# EasyEDA schematic SCH_esp_micro_usb.json
TITLE: Sheet_1; REV: 1.0; Date: 2022-09-20; Sheet: 1/1; Drawn By: elanworld; Company: Your Company
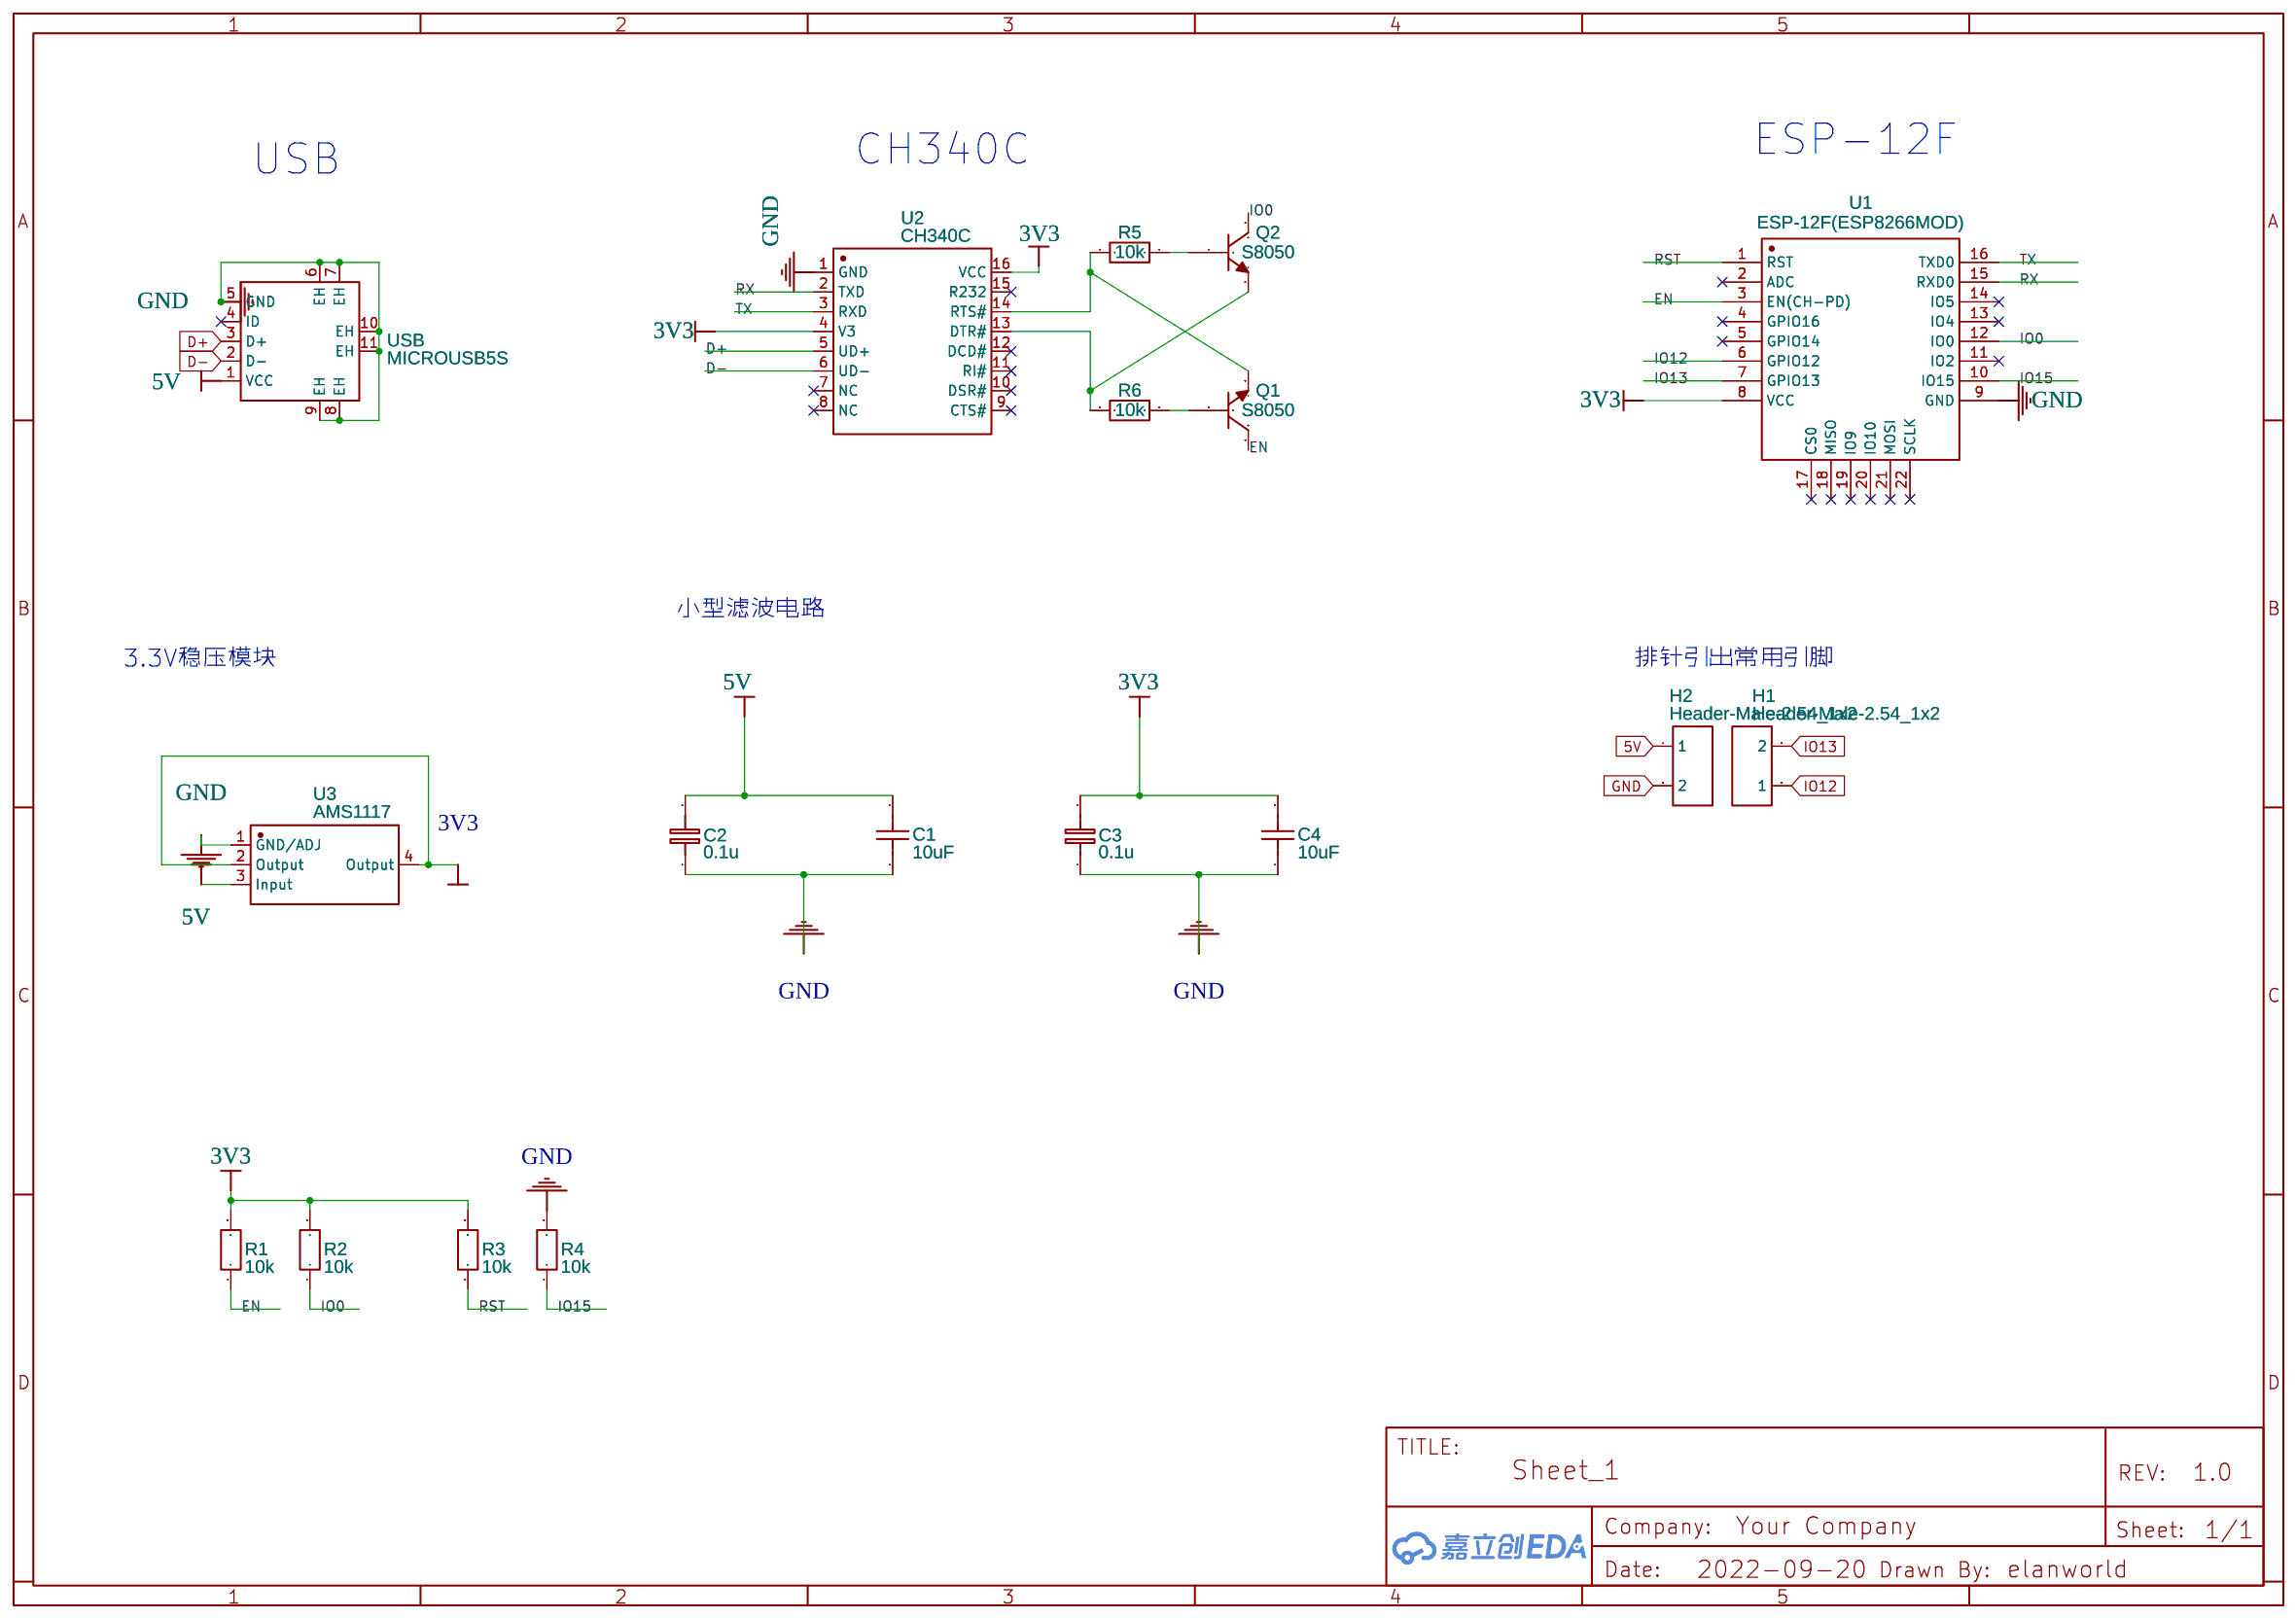
[diagram p0: schematic sheet]

## Parts
C1  10uF  [C0603]
C2  0.1u  [C0603]
C3  0.1u  [C0603]
C4  10uF  [C0603]
H1  Header-Male-2.54_1x2  [HDR-TH_2P-P2.54-V-M-1]
H2  Header-Male-2.54_1x2  [HDR-TH_2P-P2.54-V-M-1]
Q1  S8050  [SOT-23-3_L2.9-W1.5-P1.90-LS2.6-BL]
Q2  S8050  [SOT-23-3_L2.9-W1.5-P1.90-LS2.6-BL]
R1  10k  [R0603]
R2  10k  [R0603]
R3  10k  [R0603]
R4  10k  [R0603]
R5  10k  [R0603]
R6  10k  [R0603]
U1  ESP-12F(ESP8266MOD)  [WIFIM-SMD_ESP-12F-ESP8266MOD]
U2  CH340C  [SOP-16_L10.0-W3.9-P1.27-LS6.0-BL]
U3  AMS1117  [SOT-223-4_L6.5-W3.5-P2.30-LS7.0-BR]
USB  MICROUSB5S  [MICRO-USB_MICRO-USB-5S]

## Library data of the parts
C1 C4 = CL10A106MP8NNNC: Supplier: LCSC; Manufacturer: SAMSUNG; Supplier Part: C85713; JLCPCB Part Class: Extended Part
C2 C3 = C_0603_EU: Supplier Part: C1591; Contributor: LCEDA_Lib
H1 H2 = Header-Male-2.54_1x2: Supplier: LCSC; Manufacturer: TE Connectivity; Manufacturer Part: 826629-2; Supplier Part: C86471; JLCPCB Part Class: Extended Part
Q1 Q2 = -: Supplier: LCSC; Manufacturer: Yenji; Contributor: LCSC; Supplier Part: C364312; LCSC Assembly: Yes; SMT Type: Extend
R1-R4 = R_0603_EU: Supplier Part: C169103; Contributor: LCEDA_Lib
R5 R6 = Res_0603(1/10W)_EU: Supplier: LCSC; Supplier Part: C169103
U1 = ESP-12F(ESP8266MOD): Supplier: LCSC; Manufacturer: Ai-Thinker; Supplier Part: C82891; JLCPCB Part Class: Extended Part
U2 = -: Supplier: LCSC; Manufacturer: WCH; Supplier Part: C84681
U3 = AMS1117-3.3_C369933: Supplier: LCSC; Supplier Part: C369933; Manufacturer: KEXIN; Manufacturer Part: AMS1117-3.3; Contributor: LCSC; JLCPCB Part Class: Extended Part
USB = MICROUSB5S: Supplier: LCSC; Supplier Part: C9900018063; Manufacturer: null; JLCPCB Part Class: Extended Part; Contributor: lcsc

## Nets
3V3: C3.2 C4.2 R1.2 R2.2 R3.2 U1.8(VCC) U2.4(V3) U2.16(VCC) U3.2(Output) U3.4(Output)
5V: C1.2 C2.2 H2.1 U3.3(Input) USB.1(VCC)
GND: C1.1 C2.1 C3.1 C4.1 H2.2 R4.2 U1.9(GND) U2.1(GND) U3.1(GND/ADJ) USB.5(GND) USB.6(EH) USB.7(EH) USB.8(EH) USB.9(EH) USB.10(EH) USB.11(EH)
D+: U2.5(UD+) USB.3(D+)
D-: U2.6(UD-) USB.2(D-)
EN: Q1.3(C) R1.1 U1.3(EN(CH-PD))
IO0: Q2.3(C) R2.1 U1.12(IO0)
IO12: H1.1 U1.6(GPIO12)
IO13: H1.2 U1.7(GPIO13)
IO15: R4.1 U1.10(IO15)
RST: R3.1 U1.1(RST)
RX: U1.15(RXD0) U2.2(TXD)
TX: U1.16(TXD0) U2.3(RXD)
Net-(Q1-1): Q1.1(B) R6.1
Net-(Q1-2): Q1.2(E) R5.2 U2.14(RTS#)
Net-(Q2-1): Q2.1(B) R5.1
Net-(Q2-2): Q2.2(E) R6.2 U2.13(DTR#)

Not connected (* = marked no-connect by the designer): U1 2(ADC)* 4(GPIO16)* 5(GPIO14)* 11(IO2)* 13(IO4)* 14(IO5)* 17(CS0)* 18(MISO)* 19(IO9)* 20(IO10)* 21(MOSI)* 22(SCLK)*; U2 7(NC)* 8(NC)* 9(CTS#)* 10(DSR#)* 11(RI#)* 12(DCD#)* 15(R232)*; USB 4(ID)*

## Notes on the sheet
- USB
- CH340C
- ESP-12F
- 小型滤波电路
- 3.3V稳压模块
- 排针引出常用引脚
